# EAGLE design version 1.1 (EAGLE 8.1.0)

## Sheet 1 of 4
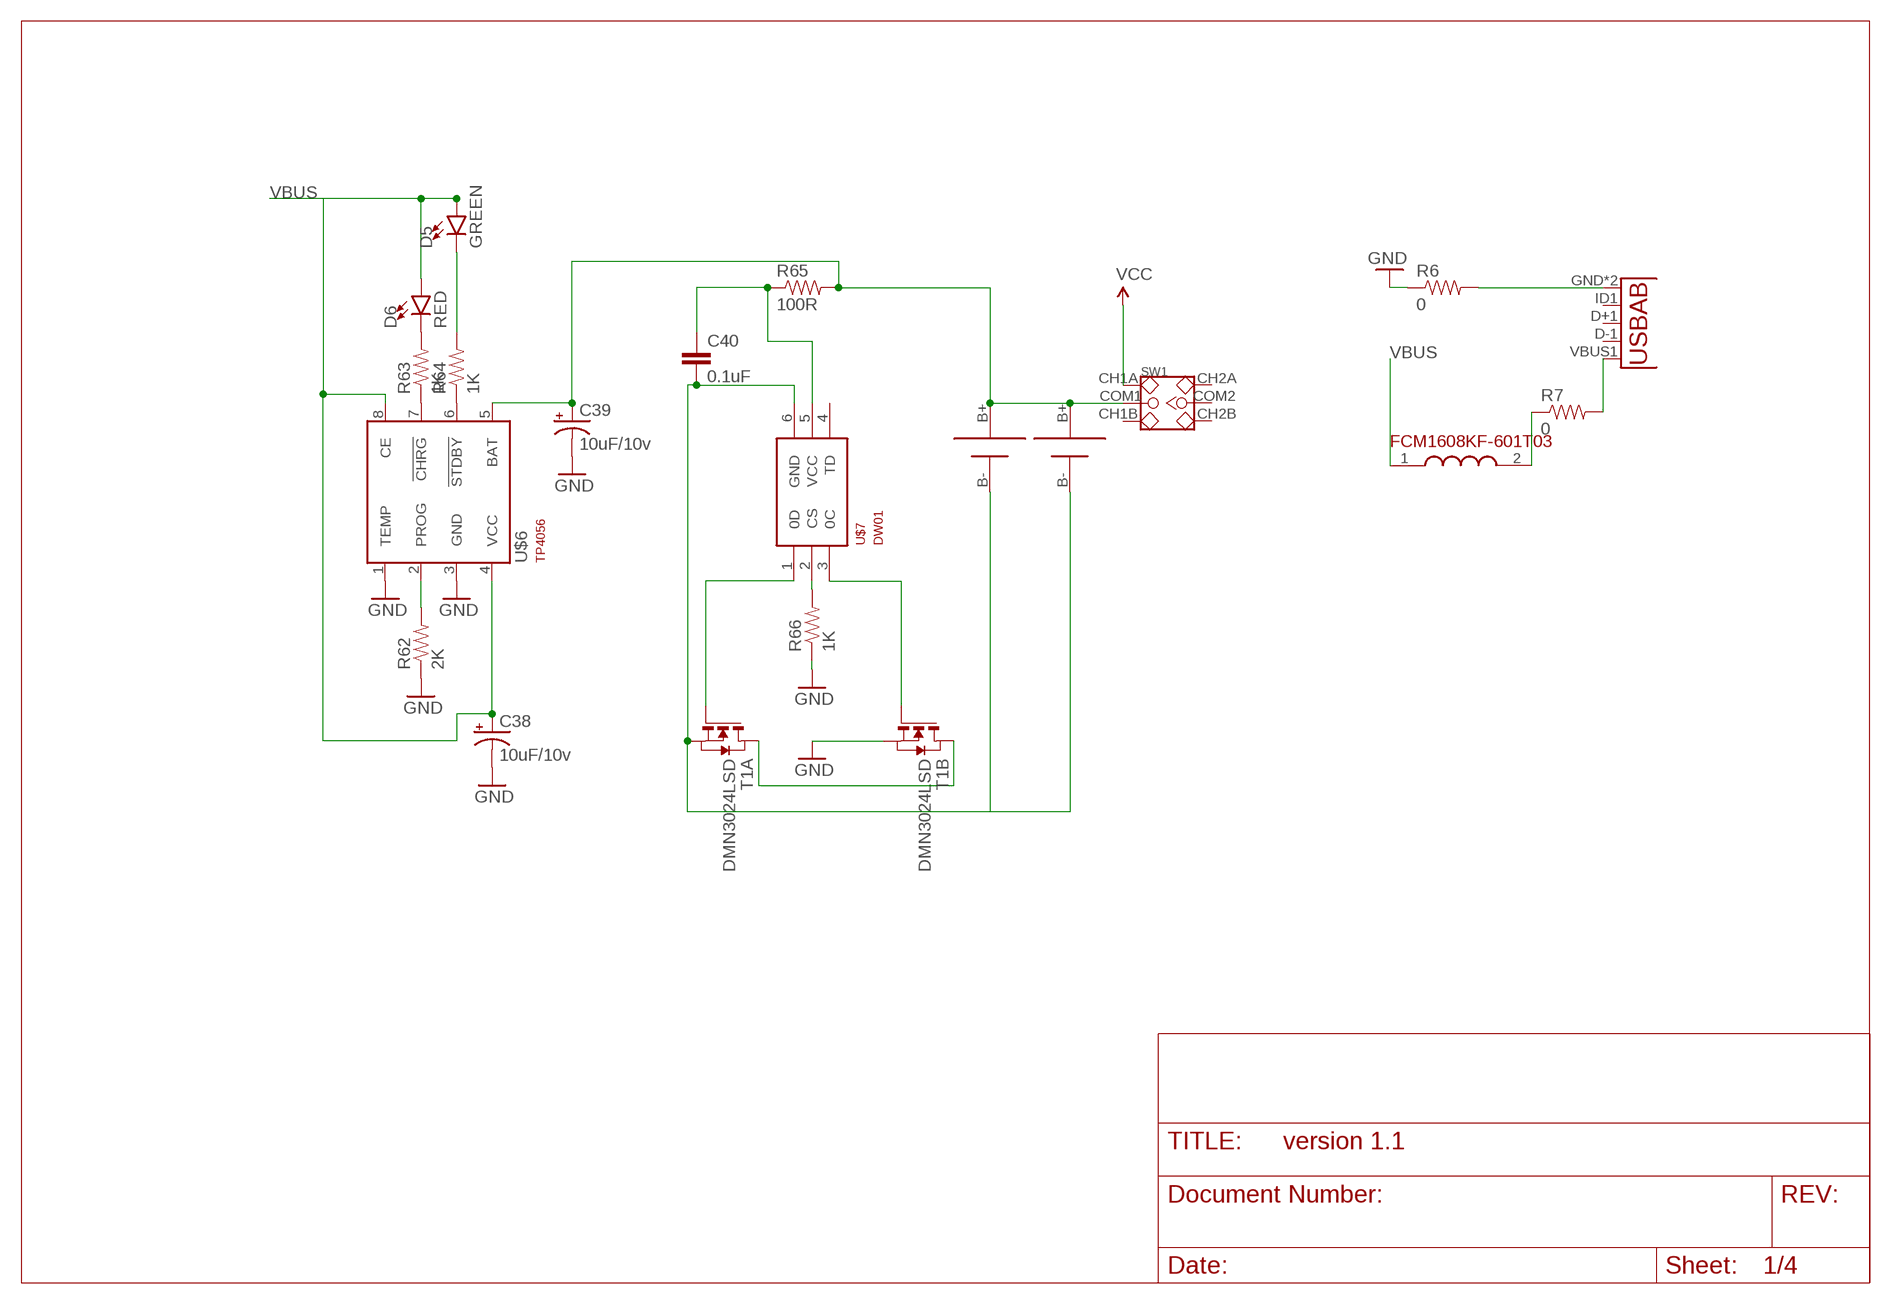
[diagram p0: schematic, sheet 1]

### Parts
C38  10uF/10v  CAP_POL1206-KIT  [EIA3216-KIT]
C39  10uF/10v  CAP_POL1206-KIT  [EIA3216-KIT]
C40  0.1uF  0.1UF-100V-10%(0603)  [0603-CAP]
D5  GREEN  LED-BLUE0603  [LED-0603]
D6  RED  LED-BLUE0603  [LED-0603]
R6  0  RESISTOR0805-RES  [0805]
R7  0  RESISTOR0805-RES  [0805]
R62  2K  1KOHM1/10W1%(0603)  [0603-RES]
R63  1K  1KOHM1/10W1%(0603)  [0603-RES]
R64  1K  1KOHM1/10W1%(0603)  [0603-RES]
R65  100R  1KOHM1/10W1%(0603)  [0603-RES]
R66  1K  1KOHM1/10W1%(0603)  [0603-RES]
SW1  SMD-TOGGLE-SWITCH-2CH(2X3P-7X3.5MM)  [SW6-2.54-SMD-7.0X3.5X1.5MM]
T1  DMN3024LSD  [TSSOP-8]
U1  USB""  [USB-MICRO-SMD]
U$4  FCM1608KF-601T03  [FCM1608KF-601T03]
U$5  18650SMD  [18650SMD]
U$6  TP4056  [SOT23-8]
U$7  DW01  [SOT23-6]
U$8  18650SMD  [18650SMD]

### Nets
GND: C38.C(-) C39.C(-) R6.1 R62.1 R66.1 T1.6(B:S) T1.7(B:S) U$6.1(TEMP) U$6.3(GND) ; also sheet 2,3,4
N$3: R7.2 U1.VBUS1(VBUS)
N$4: C39.A(+) R65.2 SW1.COM1 U$5.B+ U$6.5(BAT) U$8.B+
N$11: R7.1 U$4.2(2.OUT)
N$12: R6.2 U1.GND U1.GND1(GND)
N$58: R62.2 U$6.2(PROG)
N$59: R63.1 U$6.7(!CHRG)
N$60: R64.1 U$6.6(!STDBY)
N$61: D6.C R63.2
N$62: D5.C R64.2
N$65: C40.1 R65.1 U$7.5(VCC)
N$66: C40.2 T1.2(A:S) T1.3(A:S) U$5.B- U$7.6(GND) U$8.B-
N$67: T1.4(A:G) U$7.1(0D)
N$68: R66.2 U$7.2(CS)
N$69: T1.1(A:D) T1.8(B:D)
N$70: T1.5(B:G) U$7.3(0C)
VBUS: C38.A(+) D5.A D6.A U$4.1(1.IN) U$6.4(VCC) U$6.8(CE)
VCC: SW1.CH1A ; also sheet 2,3,4
Unconnected: SW1.CH1B SW1.CH2A SW1.CH2B SW1.COM2 U1.D+1(D+) U1.D-1(D-) U1.ID1(USBID) U$7.4(TD)

## Sheet 2 of 4
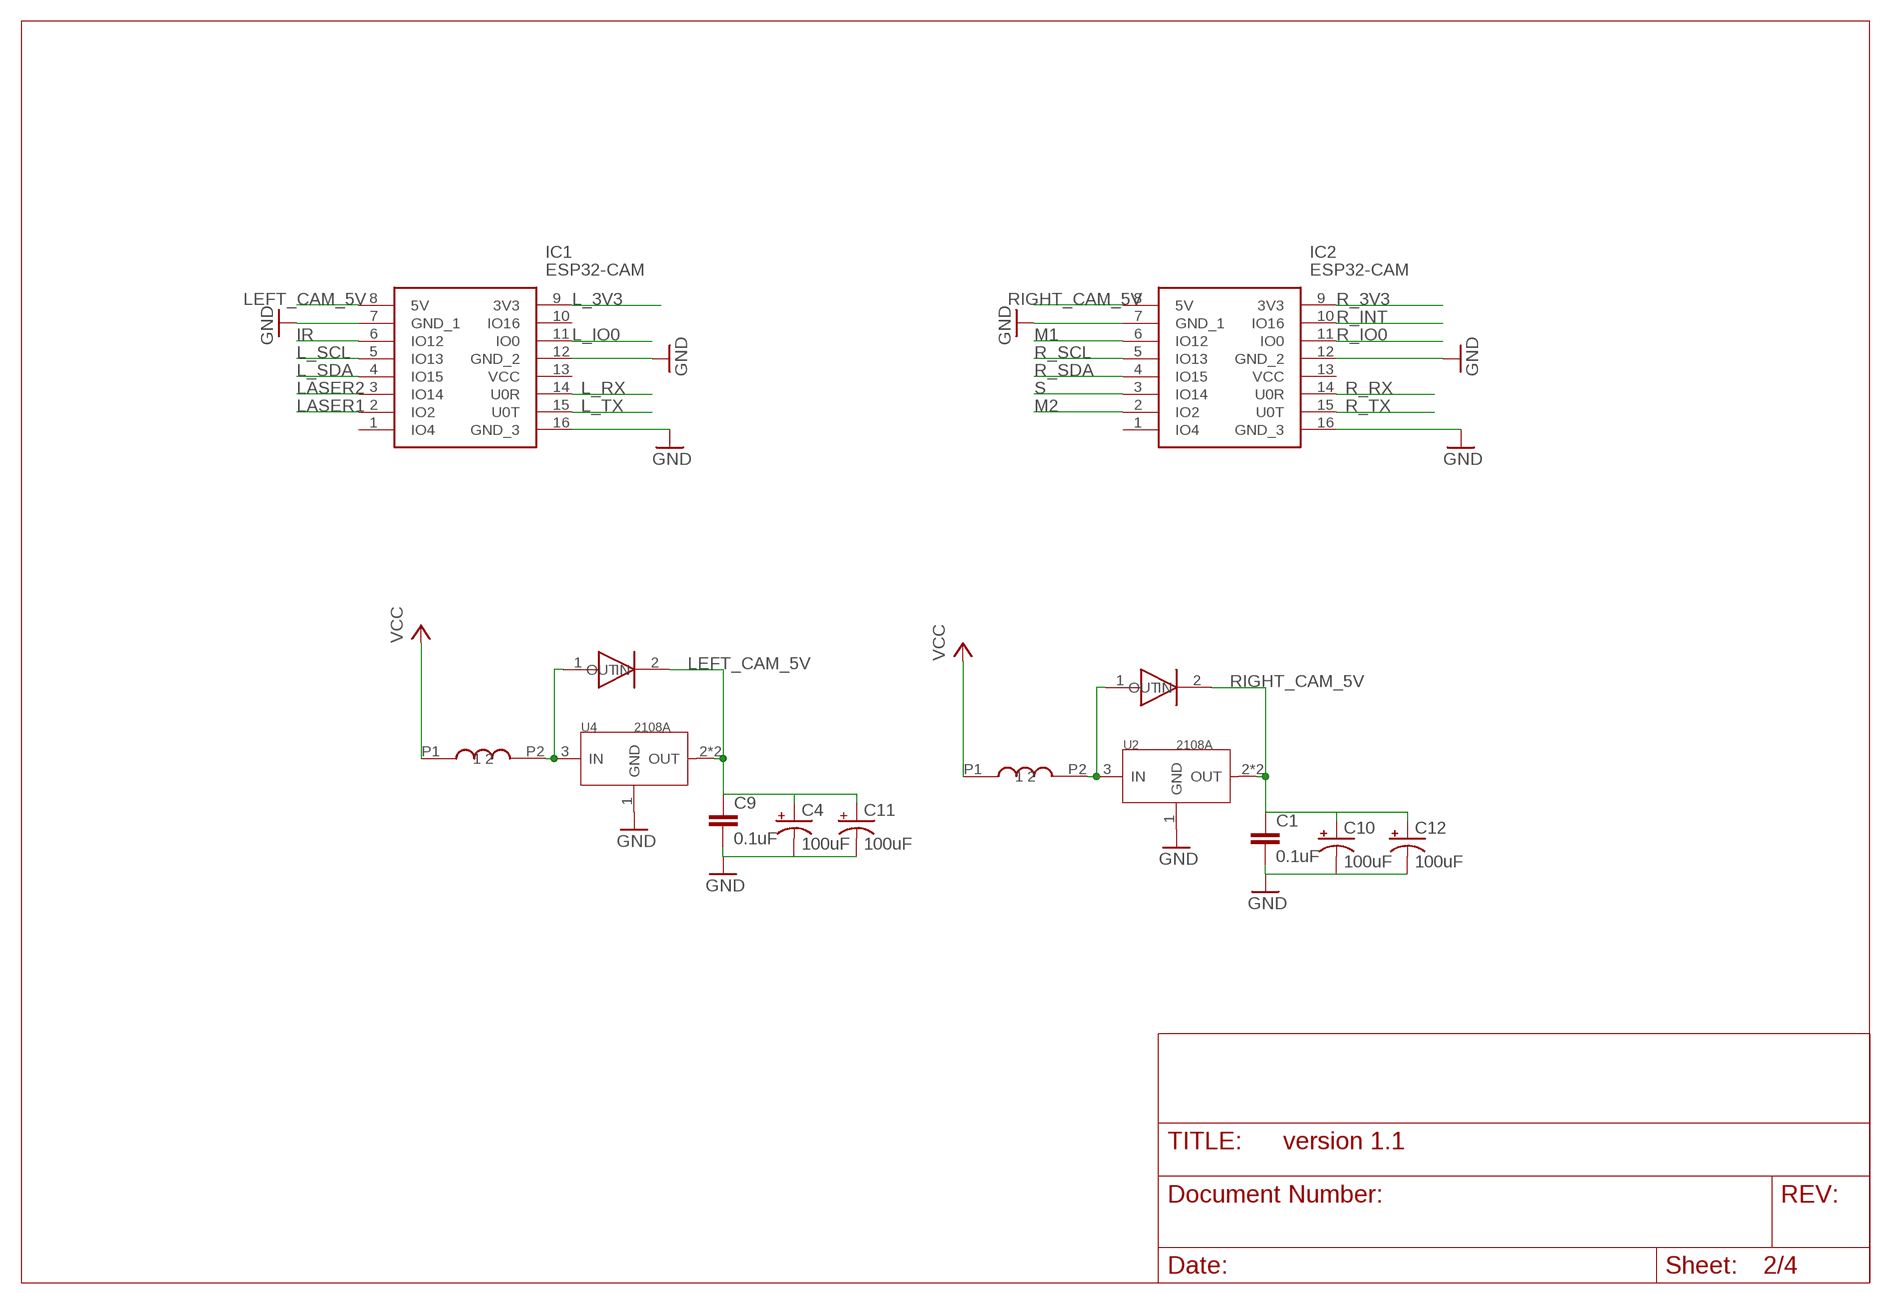
[diagram p1: schematic, sheet 2]

### Parts
C1  0.1uF  0.1UF-25V-5%(0603)  [0603-CAP]
C4  100uF  CPOL-USE/7260-38R  [E/7260-38R]
C9  0.1uF  0.1UF-25V-5%(0603)  [0603-CAP]
C10  100uF  CPOL-USE/7260-38R  [E/7260-38R]
C11  100uF  CPOL-USE/7260-38R  [E/7260-38R]
C12  100uF  CPOL-USE/7260-38R  [E/7260-38R]
IC1  ESP32-CAM  [ESP32CAM]
IC2  ESP32-CAM  [ESP32CAM]
U2  2108A  PMIC-CJA1117B-3.3(SOT-89)  [SOT-89]
U4  2108A  PMIC-CJA1117B-3.3(SOT-89)  [SOT-89]
U$13  CD54  [CD54]
U$14  SMA-SS34  [SMA-SS34]
U$15  SMA-SS34  [SMA-SS34]
U$16  CD54  [CD54]

### Nets
GND: C1.2 C4.- C9.2 C10.- C11.- C12.- IC1.7(GND_1) IC1.12(GND_2) IC1.16(GND_3) IC2.7(GND_1) IC2.12(GND_2) IC2.16(GND_3) U2.1(GND) U4.1(GND) ; also sheet 1,3,4
IR: IC1.6(IO12) ; also sheet 3
L_3V3: IC1.9(3V3) ; also sheet 4
L_IO0: IC1.11(IO0) ; also sheet 4
L_RX: IC1.14(U0R) ; also sheet 4
L_SCL: IC1.5(IO13) ; also sheet 4
L_SDA: IC1.4(IO15) ; also sheet 4
L_TX: IC1.15(U0T) ; also sheet 4
LASER1: IC1.2(IO2) ; also sheet 3
LASER2: IC1.3(IO14) ; also sheet 3
LEFT_CAM_5V: C4.+ C9.1 C11.+ IC1.8(5V) U4.2(OUT) U4.4(OUT) U$14.2(OUT) ; also sheet 4
M1: IC2.6(IO12) ; also sheet 4
M2: IC2.2(IO2) ; also sheet 4
N$17: U4.3(IN) U$13.P2 U$14.1(IN)
N$19: U2.3(IN) U$15.1(IN) U$16.P2
R_3V3: IC2.9(3V3) ; also sheet 4
R_INT: IC2.10(IO16) ; also sheet 4
R_IO0: IC2.11(IO0) ; also sheet 4
R_RX: IC2.14(U0R) ; also sheet 4
R_SCL: IC2.5(IO13) ; also sheet 4
R_SDA: IC2.4(IO15) ; also sheet 4
R_TX: IC2.15(U0T) ; also sheet 4
RIGHT_CAM_5V: C1.1 C10.+ C12.+ IC2.8(5V) U2.2(OUT) U2.4(OUT) U$15.2(OUT) ; also sheet 4
S: IC2.3(IO14) ; also sheet 4
VCC: U$13.P1 U$16.P1 ; also sheet 1,3,4
Unconnected: IC1.1(IO4) IC1.10(IO16) IC1.13(VCC) IC2.1(IO4) IC2.13(VCC)

## Sheet 3 of 4
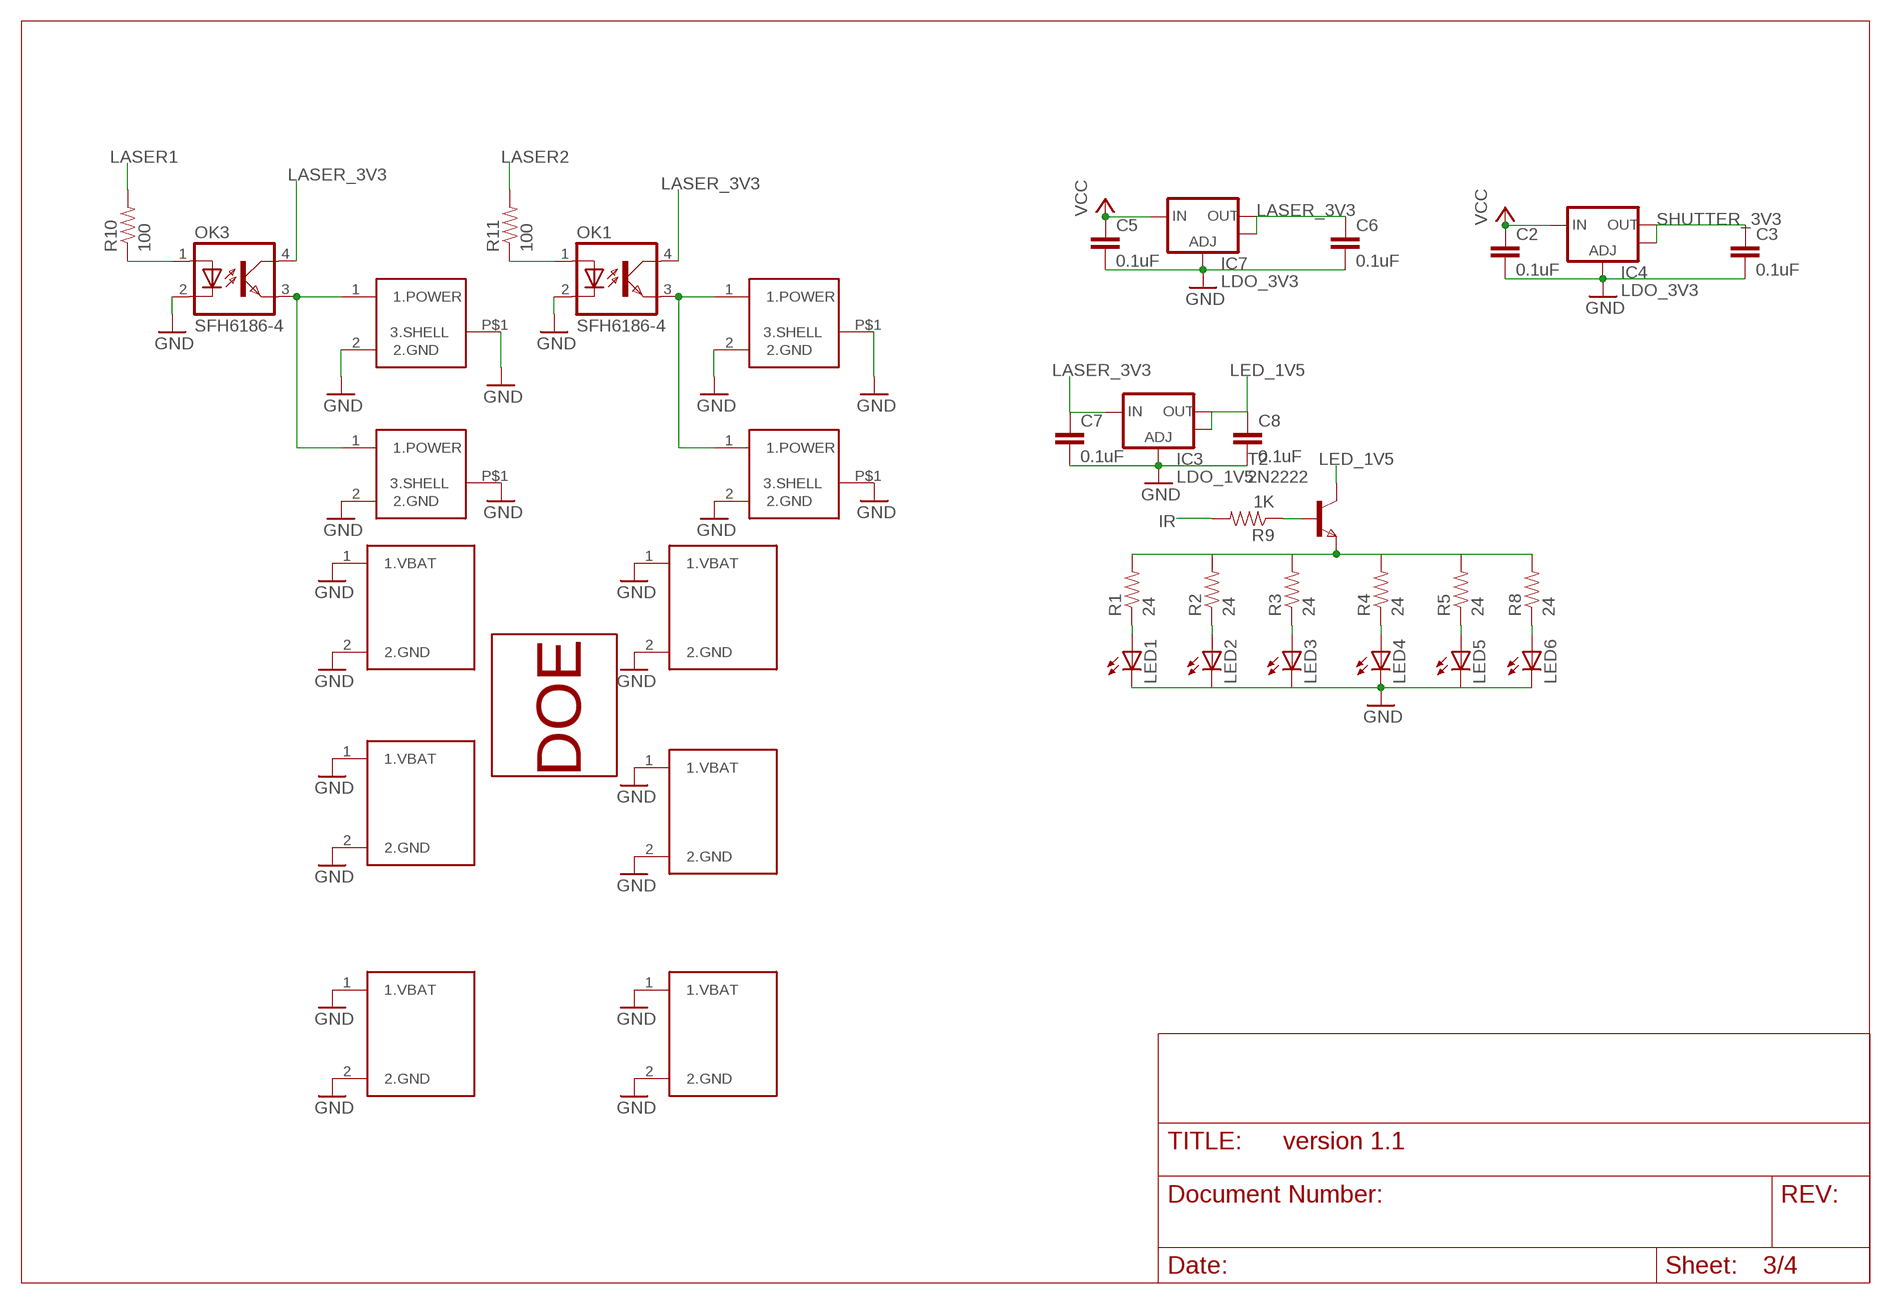
[diagram p2: schematic, sheet 3]

### Parts
C2  0.1uF  0.1UF-100V-10%(0603)  [0603-CAP]
C3  0.1uF  0.1UF-100V-10%(0603)  [0603-CAP]
C5  0.1uF  0.1UF-100V-10%(0603)  [0603-CAP]
C6  0.1uF  0.1UF-100V-10%(0603)  [0603-CAP]
C7  0.1uF  0.1UF-100V-10%(0603)  [0603-CAP]
C8  0.1uF  0.1UF-100V-10%(0603)  [0603-CAP]
IC3  LDO_1V5  V_REG_LM1117SOT223  [SOT223]
IC4  LDO_3V3  V_REG_LM1117SOT223  [SOT223]
IC7  LDO_3V3  V_REG_LM1117SOT223  [SOT223]
LED1  LED5MM  [LED5MM]
LED2  LED5MM  [LED5MM]
LED3  LED5MM  [LED5MM]
LED4  LED5MM  [LED5MM]
LED5  LED5MM  [LED5MM]
LED6  LED5MM  [LED5MM]
OK1  SFH6186-4  [SMD4-7]
OK3  SFH6186-4  [SMD4-7]
R1  24  1KOHM1/10W1%(0603)  [0603-RES]
R2  24  1KOHM1/10W1%(0603)  [0603-RES]
R3  24  1KOHM1/10W1%(0603)  [0603-RES]
R4  24  1KOHM1/10W1%(0603)  [0603-RES]
R5  24  1KOHM1/10W1%(0603)  [0603-RES]
R8  24  1KOHM1/10W1%(0603)  [0603-RES]
R9  1K  1KOHM1/10W1%(0603)  [0603-RES]
R10  100  1KOHM1/10W1%(0603)  [0603-RES]
R11  100  1KOHM1/10W1%(0603)  [0603-RES]
T2  2N2222  FMMT451  [SOT-23]
U$1  OD-6.5MM-LASER  [OD-6.5MM-LASER]
U$2  OD-6.5MM-LASER  [OD-6.5MM-LASER]
U$3  DOE-MODULE  [DOE-MODULE]
U$9  CR2025-HOLDER  [CR2025-HOLDER]
U$10  CR2025-HOLDER  [CR2025-HOLDER]
U$11  CR2025-HOLDER  [CR2025-HOLDER]
U$12  CR2025-HOLDER  [CR2025-HOLDER]
U$17  CR2025-HOLDER  [CR2025-HOLDER]
U$18  CR2025-HOLDER  [CR2025-HOLDER]
U$19  OD-9MM-LASER  [OD-9MM-LASER]
U$20  OD-12MM-LASER  [OD-12MM-LASER]

### Nets
GND: C2.2 C3.2 C5.2 C6.2 C7.2 C8.2 IC3.1(ADJ) IC4.1(ADJ) IC7.1(ADJ) LED1.K(C) LED2.K(C) LED3.K(C) LED4.K(C) LED5.K(C) LED6.K(C) OK1.2(C) OK3.2(C) U$1.2(2.GND) U$1.P$1(3.SHELL) U$2.2(2.GND) U$2.P$1(3.SHELL) U$9.1(1.VBAT) U$9.2(2.GND) U$10.1(1.VBAT) U$10.2(2.GND) U$11.1(1.VBAT) U$11.2(2.GND) U$12.1(1.VBAT) U$12.2(2.GND) U$17.1(1.VBAT) U$17.2(2.GND) U$18.1(1.VBAT) U$18.2(2.GND) U$19.2(2.GND) U$19.P$1(3.SHELL) U$20.2(2.GND) U$20.P$1(3.SHELL) ; also sheet 1,2,4
IR: R9.2 ; also sheet 2
LASER1: R10.2 ; also sheet 2
LASER2: R11.2 ; also sheet 2
LASER_3V3: C6.1 C7.1 IC3.3(IN) IC7.2(OUT) IC7.4(OUT) OK1.4(COL) OK3.4(COL)
LED_1V5: C8.1 IC3.2(OUT) IC3.4(OUT) T2.1(C)
N$5: OK3.3(EMIT) U$1.1(1.POWER) U$20.1(1.POWER)
N$6: OK1.3(EMIT) U$2.1(1.POWER) U$19.1(1.POWER)
N$7: OK3.1(A) R10.1
N$8: OK1.1(A) R11.1
N$9: LED1.A R1.1
N$10: LED2.A R2.1
N$13: LED3.A R3.1
N$14: LED4.A R4.1
N$15: LED5.A R5.1
N$16: LED6.A R8.1
N$18: R1.2 R2.2 R3.2 R4.2 R5.2 R8.2 T2.2(E)
N$21: R9.1 T2.3(B)
SHUTTER_3V3: C3.1 IC4.2(OUT) IC4.4(OUT) ; also sheet 4
VCC: C2.1 C5.1 IC4.3(IN) IC7.3(IN) ; also sheet 1,2,4

## Sheet 4 of 4
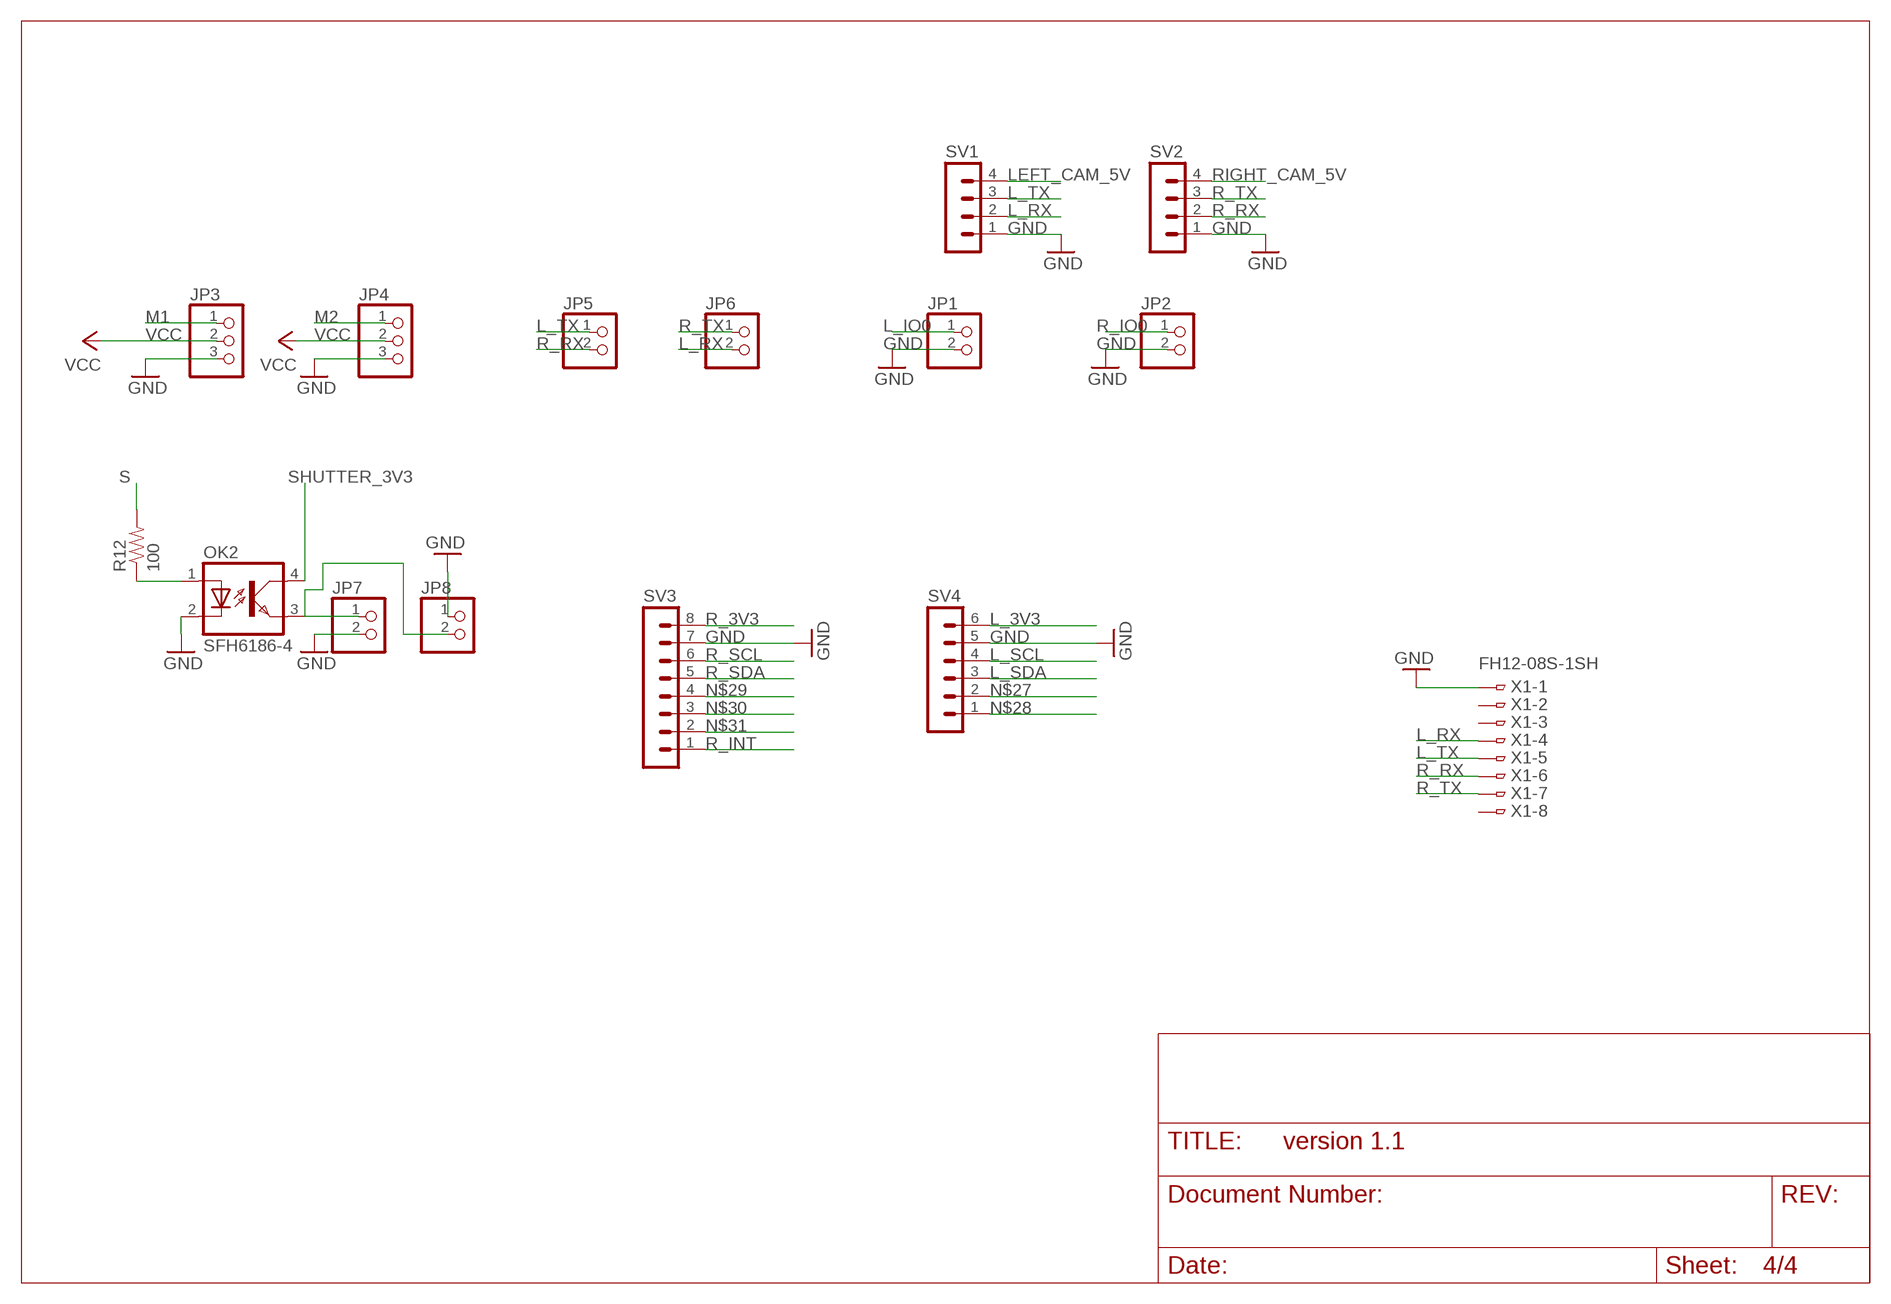
[diagram p3: schematic, sheet 4]

### Parts
JP1  PINHD-1X2  [1X02]
JP2  PINHD-1X2  [1X02]
JP3  PINHD-1X3  [1X03]
JP4  PINHD-1X3  [1X03]
JP5  PINHD-1X2  [1X02]
JP6  PINHD-1X2  [1X02]
JP7  PINHD-1X2  [1X02]
JP8  PINHD-1X2  [1X02]
OK2  SFH6186-4  [SMD4-7]
R12  100  1KOHM1/10W1%(0603)  [0603-RES]
SV1  MA04-1  [MA04-1]
SV2  MA04-1  [MA04-1]
SV3  MA08-1  [MA08-1]
SV4  MA06-1  [MA06-1]
X1  FH12-08S-1SH  [FH12-08S-1SH]

### Nets
GND: JP1.2 JP2.2 JP3.3 JP4.3 JP7.2 JP8.1 OK2.2(C) SV1.1 SV2.1 SV3.7 SV4.5 X1.1 ; also sheet 1,2,3
L_3V3: SV4.6 ; also sheet 2
L_IO0: JP1.1 ; also sheet 2
L_RX: JP6.2 SV1.2 X1.4 ; also sheet 2
L_SCL: SV4.4 ; also sheet 2
L_SDA: SV4.3 ; also sheet 2
L_TX: JP5.1 SV1.3 X1.5 ; also sheet 2
LEFT_CAM_5V: SV1.4 ; also sheet 2
M1: JP3.1 ; also sheet 2
M2: JP4.1 ; also sheet 2
N$20: OK2.1(A) R12.1
N$22: JP7.1 JP8.2 OK2.3(EMIT)
N$27: SV4.2
N$28: SV4.1
N$29: SV3.4
N$30: SV3.3
N$31: SV3.2
R_3V3: SV3.8 ; also sheet 2
R_INT: SV3.1 ; also sheet 2
R_IO0: JP2.1 ; also sheet 2
R_RX: JP5.2 SV2.2 X1.6 ; also sheet 2
R_SCL: SV3.6 ; also sheet 2
R_SDA: SV3.5 ; also sheet 2
R_TX: JP6.1 SV2.3 X1.7 ; also sheet 2
RIGHT_CAM_5V: SV2.4 ; also sheet 2
S: R12.2 ; also sheet 2
SHUTTER_3V3: OK2.4(COL) ; also sheet 3
VCC: JP3.2 JP4.2 ; also sheet 1,2,3
Unconnected: X1.2 X1.3 X1.8

## Library data of the parts
C1 C9 = SparkFun-Capacitors:0.1UF-25V-5%(0603): CAP-08604; PROD_ID: CAP-08604
C2 C3 C5-C8 C40 = SparkFun-Capacitors:0.1UF-100V-10%(0603): CAP-08390; PROD_ID: CAP-08390
C4 C10-C12 = adafruit:CPOL-US: POLARIZED CAPACITOR, American symbol
C38 C39 = SparkFun-Capacitors:CAP_POL: Capacitor Polarized These are standard SMD and PTH capacitors. Normally 10uF, 47uF, and 100uF in electrolytic and tantalum varieties. Always verify the external diameter of the through hole cap, it varies with capacity, voltage, and manufacturer. The EIA devices should be standard.
D5 D6 = SparkFun-LED:LED-BLUE: Blue SMD LED Used in manufacturing of various products at SparkFun Packages: 0603 - SMD 0603 package [Product Link] <http://www.digikey.com/product-detail/en/SMLE12BC7TT86/511-1589-2-ND/1641808> 1206 - SMD1206 package [Product Link] <http://www.digikey.com/product-detail/en/lite-on-inc/LTST-C150TBKT/160-1643-1-ND/573584> SparkFun Products: ESP8266 Thing-Dev Board <https://www.sparkfun.com/products/13711> RedBoard <https://www.sparkfun.com/products/12757>; PROD_ID: DIO-08575; VALUE: BLUE
IC1 IC2 = ESP32-CAM:ESP32-CAM: Modules PCBA Module RoHS Source: Datasheet <https://datasheet.lcsc.com/szlcsc/Ai-Thinker-ESP32-CAM_C277946.pdf>; DESCRIPTION: Modules PCBA Module RoHS; HEIGHT: 5mm; MANUFACTURER_NAME: Ai-Thinker; MANUFACTURER_PART_NUMBER: ESP32-CAM
IC3 IC4 IC7 = SparkFun-PowerIC:V_REG_LM1117: Voltage Regulator LM1117 Standard adjustable voltage regulator but in SMD form. Spark Fun Electronics SKU : COM-00595
JP1 JP2 JP5-JP8 = pinhead:PINHD-1X2: PIN HEADER
JP3 JP4 = adafruit:PINHD-1X3: PIN HEADER
LED1-LED6 = adafruit:LED: LED OSRAM: - CHIPLED LG R971, LG N971, LY N971, LG Q971, LY Q971, LO R971, LY R971 LH N974, LH R974 LS Q976, LO Q976, LY Q976 LO Q996 - Hyper CHIPLED LW Q18S LB Q993, LB Q99A, LB R99A - SideLED LS A670, LO A670, LY A670, LG A670, LP A670 LB A673, LV A673, LT A673, LW A673 LH A674 LY A675 LS A676, LA A676, LO A676, LY A676, LW A676 LS A679, LY A679, LG A679 - Hyper Micro SIDELED® LS Y876, LA Y876, LO Y876, LY Y876 LT Y87S - SmartLED LW L88C, LW L88S LB L89C, LB L89S, LG L890 LS L89K, LO L89K, LY L89K LS L896, LA L896, LO L896, LY L896 - TOPLED LS T670, LO T670, LY T670, LG T670, LP T670 LSG T670, LSP T670, LSY T670, LOP T670, LYG T670 LG T671, LOG T671, LSG T671 LB T673, LV T673, LT T673, LW T673 LH T674 LS T676, LA T676, LO T676, LY T676, LB T676, LH T676, LSB T676, LW T676 LB T67C, LV T67C, LT T67C, LS T67K, LO T67K, LY T67K, LW E67C LS E67B, LA E67B, LO E67B, LY E67B, LB E67C, LV E67C, LT E67C LW T67C LS T679, LY T679, LG T679 LS T770, LO T770, LY T770, LG T770, LP T770 LB T773, LV T773, LT T773, LW T773 LH T774 LS E675, LA E675, LY E675, LS T675 LS T776, LA T776, LO T776, LY T776, LB T776 LHGB T686 LT T68C, LB T68C - Hyper Mini TOPLED® LB M676 - Mini TOPLED Santana® LG M470 LS M47K, LO M47K, LY M47K Source: http://www.osram.convergy.de/
OK1-OK3 = optocoupler:SFH618?*: Optocoupler, Phototransistor Output, Low Input Current Source: Data sheet <http://www.vishay.com/docs/83673/sfh618.pdf>; MF: VISHAY/TELEFUNKEN; MPN: SFH6186-4; OC_FARNELL: 1469530; OC_NEWARK: 21H7753
R1-R5 R8 R10-R12 R62 R65 = SparkFun-Resistors:1KOHM1/10W1%(0603): RES-07856; PROD_ID: RES-07856; VALUE: 1K
R6 R7 = SparkFun-Resistors:RESISTOR: Resistor Basic schematic elements and footprints for 0603, 1206, and PTH resistors.
R9 R63 R64 R66 = SparkFun-Resistors:1KOHM1/10W1%(0603): RES-07856; PROD_ID: RES-07856
SV1 SV2 = con-lstb:MA04-1: PIN HEADER; OC_FARNELL: unknown; OC_NEWARK: unknown
SV3 = con-lstb:MA08-1: PIN HEADER; OC_FARNELL: unknown; OC_NEWARK: unknown
SV4 = con-lstb:MA06-1: PIN HEADER; OC_FARNELL: unknown; OC_NEWARK: unknown
SW1 = Seeed-OPL-Switch:SMD-TOGGLE-SWITCH-2CH(2X3P-7X3.5MM): 311030005
T1 = FS8205A:DMN3024LSD: DUAL N-CHANNEL ENHANCEMENT MODE MOSFET data sheet <http://goo.gl/dRgboR> Dave.Calaway Eagle Library <https://goo.gl/Muy1Tr>
T2 = zetex:FMMT451: NPN TRANSISTOR; OC_FARNELL: unknown; OC_NEWARK: unknown
U1 = MicroUSB Long GND:USB: This is a USB AB connector that is compatible with USB OTG. i.e. this connector can serve as a host or device
U2 U4 = Seeed-OPL-ic:PMIC-CJA1117B-3.3(SOT-89): 310030095; MPN: CJA1117B-3.3; VALUE: CJA1117B-3.3-SOT89
U$1 U$2 = OD-6.5MM-LASER:OD-6.5MM-LASER
U$3 = DOE-MODULE:DOE-MODULE
U$4 = FCM1608KF-601T03:FCM1608KF-601T03
U$5 U$8 = 18650SMD:18650SMD
U$6 = TP4056:TP4056: TP4056 Data sheet <http://goo.gl/J7k8TF> Dave.Calaway Eagle Library <https://goo.gl/Muy1Tr>
U$7 = DW01:DW01: The DW01-P battery protection IC is designed to protect lithium-ion/polymer battery from damage or degrading the lifetime due to overcharge, overdischarge, and/or overcurrent for one-cell lithium-ion/polymer battery powered systems, such as cellular phones. Data sheet <http://goo.gl/4y108d> Dave.Calaway Eagle Library <https://goo.gl/Muy1Tr>
U$9-U$12 U$17 U$18 = CR2025-HOLDER:CR2025-HOLDER
U$13 U$16 = CD54:CD54
U$14 U$15 = SMA-SS34:SMA-SS34
U$19 = OD-9MM-LASER:OD-9MM-LASER
U$20 = OD-12MM-LASER:OD-12MM-LASER
X1 = con-hirose:FH12-08S-1S: 1mm Pitch Connectors For FPC/FFC Source: Data sheet <http://www.hirose.co.jp/cataloge_hp/e58605370.pdf>; OC_FARNELL: unknown; OC_NEWARK: unknown

## Board
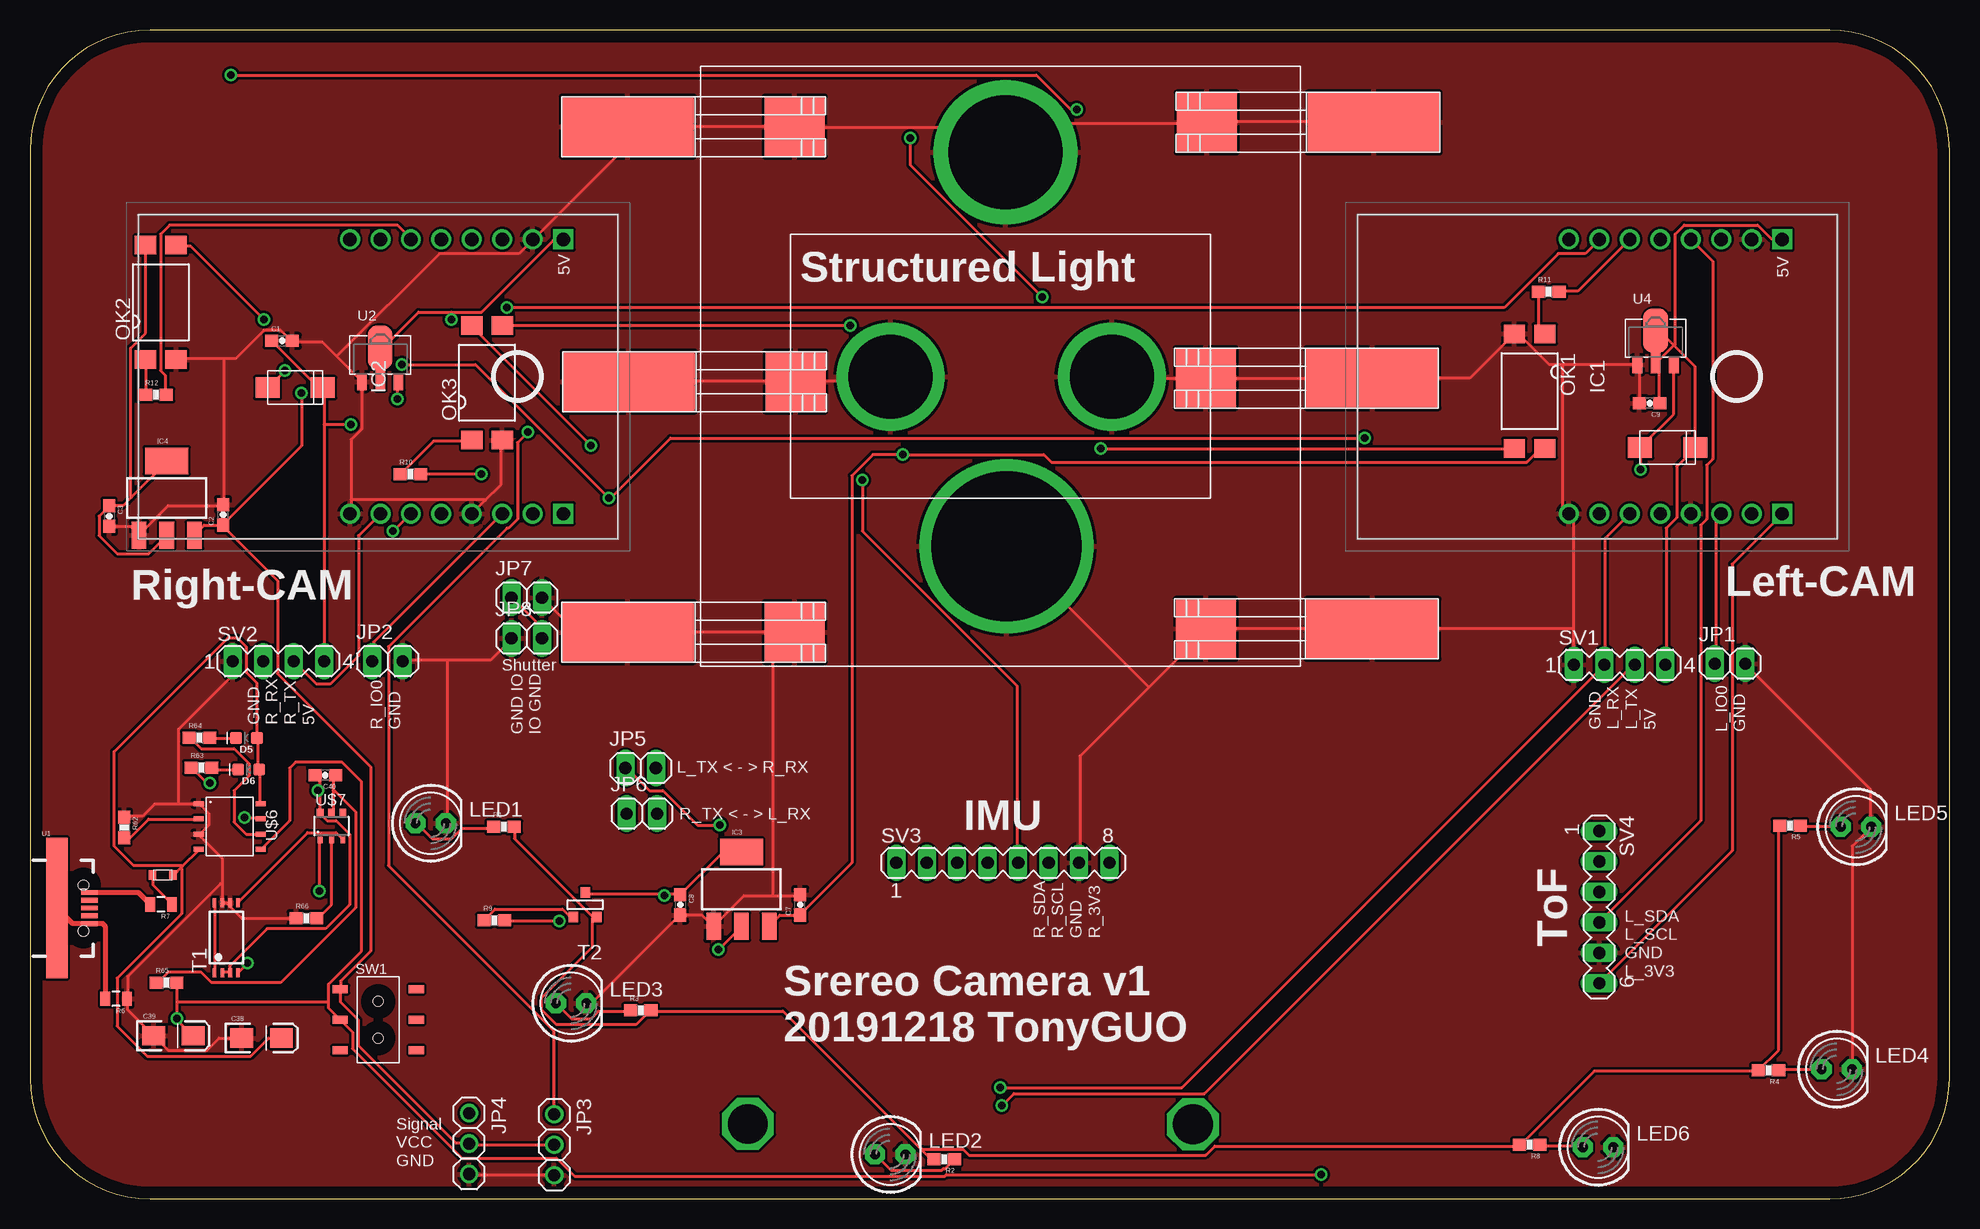
[diagram p4: board, top side]
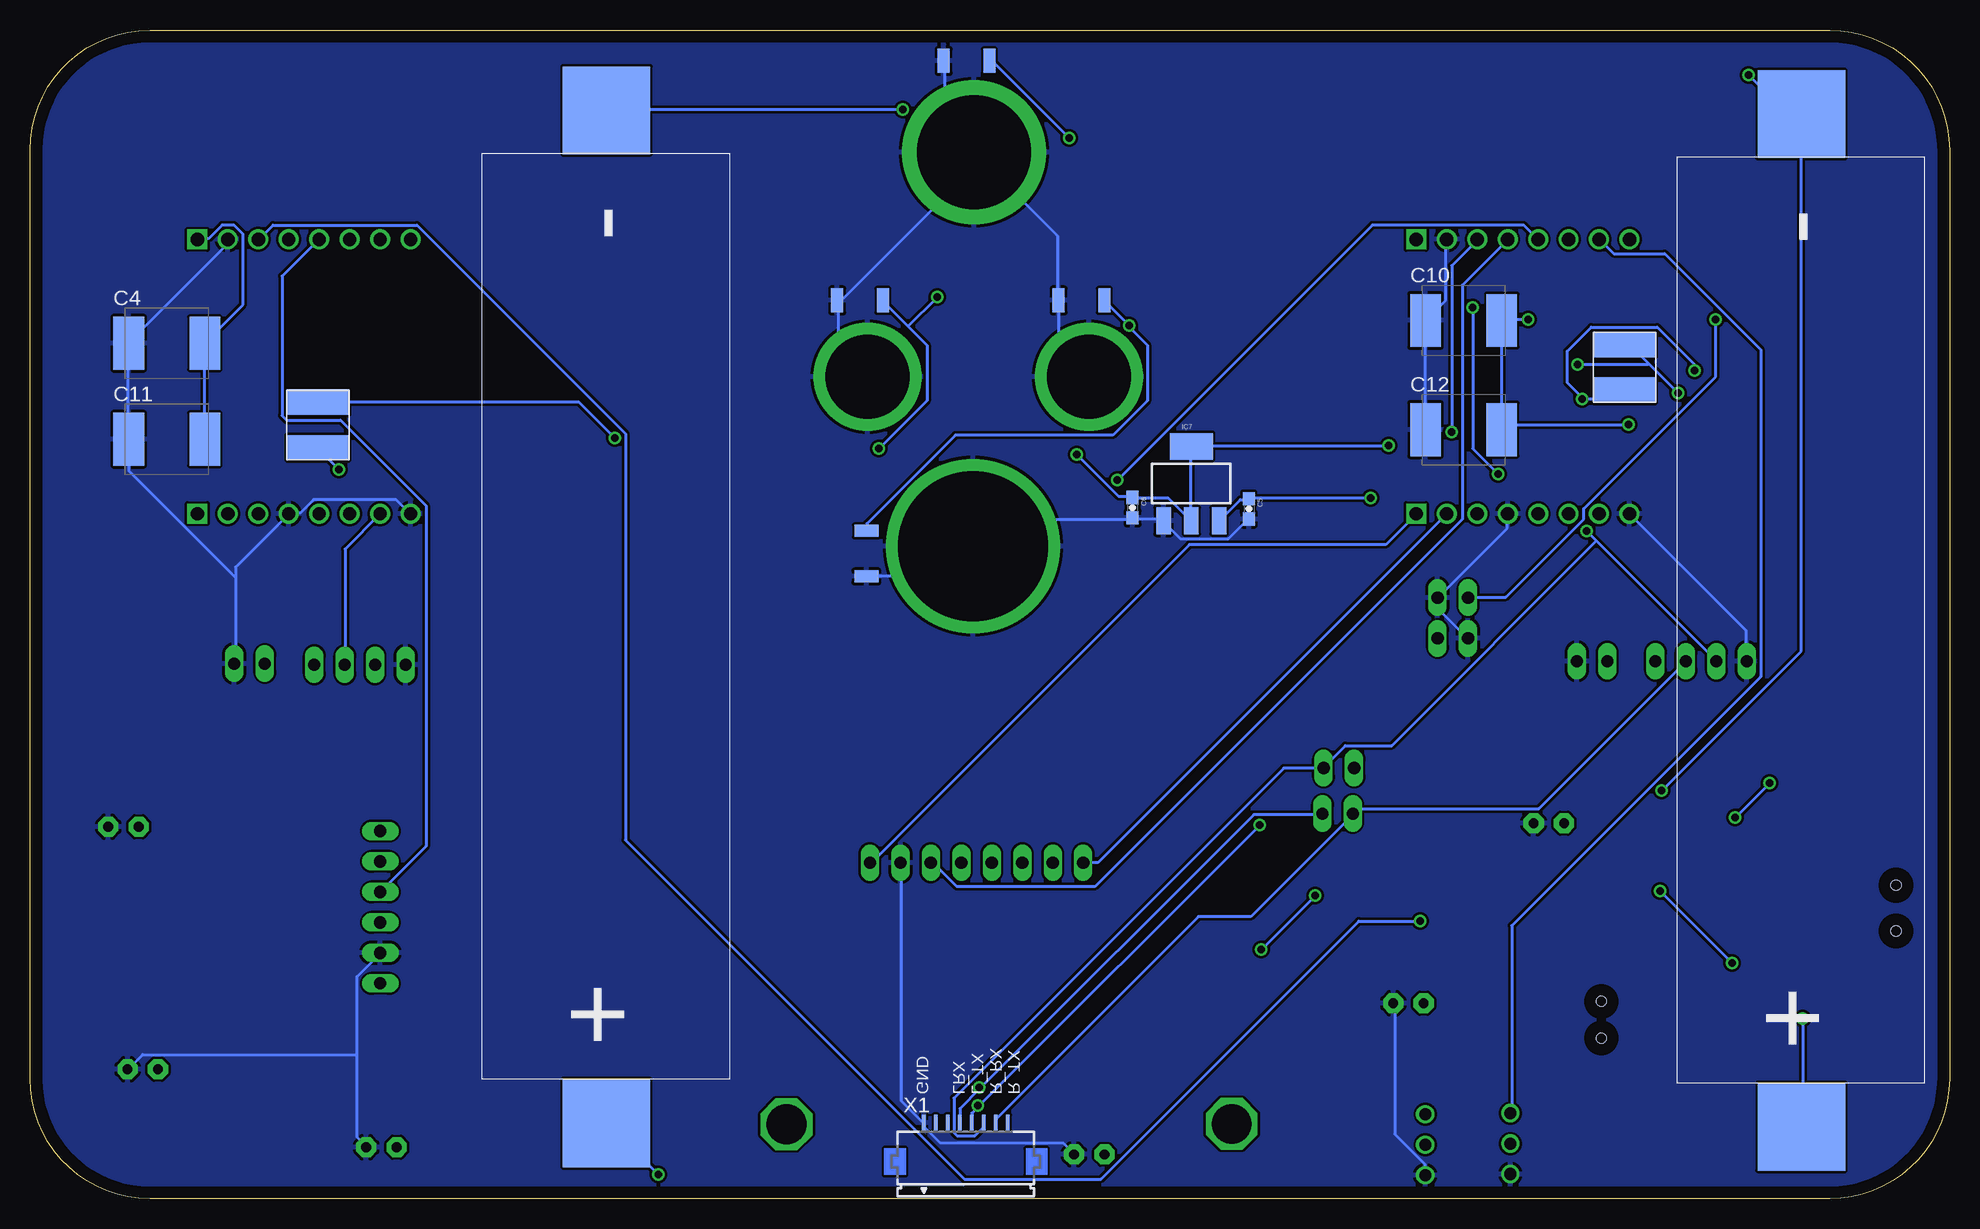
[diagram p5: board, bottom side, seen from below]

Size 160 x 97.4 mm. Coordinates in mm from the lower left corner, seen from the top.
Outline: 150,97.4 10,97.4 arc90 0,87.4 0,10 arc90 10,0 150,0 arc90 160,10 160,87.4 arc90 150,97.4
Copper layers (1*16): Top 0.035mm / dielectric 1.5mm / Bottom 0.035mm
Design rules "default": minimum track width 10mil, minimum drill 24mil, track to track 8mil, track to pad 8mil, pad to pad 8mil, via to via 8mil, smd to smd 8mil, copper to edge 40mil, drill to drill 8mil, minimum pad ring 10mil, minimum via ring 8mil, stop-mask expansion 4mil, vias tented up to drill 0mil, thermal gap 10mil

### Footprints (pad centres in the part's own frame; a part is rotated, then mirrored left to right if it is on the bottom)
0603-CAP = smd 1.1 x 1: 1 -0.85,0; 2 0.85,0
E/7260-38R = smd 2.55 x 4.4: + 3.175,0; - -3.175,0
EIA3216-KIT = smd 1.9 x 1.6: A 1.65,0; C -1.65,0
LED-0603 = smd 1 x 1: A -0.877,0; C 0.877,0
ESP32CAM = drill 1.11 pad 1.665: 1 0,0; 2 0,2.54; 3 0,5.08; 4 0,7.62; 5 0,10.16; 6 0,12.7; 7 0,15.24; 10 22.86,15.24; 11 22.86,12.7; 12 22.86,10.16; 13 22.86,7.62; 14 22.86,5.08; 15 22.86,2.54; 16 22.86,0 | drill 1.11 pad 1.665 square: 8 0,17.78; 9 22.86,17.78
SOT223 = smd 1.219 x 2.235: 1 -2.311,-3.099; 2 0,-3.099; 3 2.311,-3.099 | smd 3.6 x 2.2: 4 0,3.099
1X02 = drill 1.016 long: 1 -1.27,0; 2 1.27,0
1X03 = drill 1.016: 1 -2.54,0; 2 0,0; 3 2.54,0
LED5MM = drill 0.813 pad 1.676 octagon: A -1.27,0; K 1.27,0
SMD4-7 = smd 1.78 x 1.55: 1 -1.27,-4.77; 2 1.27,-4.77; 3 1.27,4.77; 4 -1.27,4.77
0603-RES = smd 1.1 x 1: 1 -0.85,0; 2 0.85,0
0805 = smd 0.8 x 1.2: 1 -0.9,0; 2 0.9,0
MA04-1 = drill 1.016 long: 1 -3.81,0; 2 -1.27,0; 3 1.27,0; 4 3.81,0
MA08-1 = drill 1.016 long: 1 -8.89,0; 2 -6.35,0; 3 -3.81,0; 4 -1.27,0; 5 1.27,0; 6 3.81,0; 7 6.35,0; 8 8.89,0
MA06-1 = drill 1.016 long: 1 -6.35,0; 2 -3.81,0; 3 -1.27,0; 4 1.27,0; 5 3.81,0; 6 6.35,0
SW6-2.54-SMD-7.0X3.5X1.5MM = smd 1.27 x 0.635: CH1A -3.175,2.54; CH1B -3.175,-2.54; CH2A 3.175,2.54; CH2B 3.175,-2.54; COM1 -3.175,0; COM2 3.175,0 | hole 0.813: 0,1.524; 0,-1.524
TSSOP-8 = smd 0.3 x 0.75: 1 -0.975,-2.925; 2 -0.325,-2.925; 3 0.325,-2.925; 4 0.975,-2.925; 5 0.975,2.925; 6 0.325,2.925; 7 -0.325,2.925; 8 -0.975,2.925
SOT-23 = smd 0.787 x 0.889: 1 0.025,-1.016; 2 -0.94,1.016; 3 0.991,1.016
USB-MICRO-SMD = smd 1.4 x 0.4: D+1 2.7,0; D-1 2.7,0.65; GND1 2.7,-1.3; ID1 2.7,-0.65; VBUS1 2.7,1.3 | smd 1.778 x 11.684: GND 0,0 | hole 0.85: 2.2,1.9; 2.2,-1.9
SOT-89 = smd 0.8 x 1.4: 1 -1.524,-1.905; 3 1.524,-1.905 | smd 0.8 x 1.9: 2 0,-1.651 | smd 2.032 x 3.65: 4 0,0.94
OD-6.5MM-LASER = smd 2 x 1: 1 -6.35,1.27; 2 -6.35,-2.54 | drill 7 pad 9: P$1 0,0
FCM1608KF-601T03 = smd 0.6 x 0.8: 1 -0.05,0.4; 2 1.65,0.4
18650SMD = smd 7.3 x 7.3: B+ -3.7,10.3; B- 80.7,10.3
SOT23-8 = smd 0.42 x 0.835: 1 -1.905,-2.58; 2 -0.635,-2.58; 3 0.635,-2.58; 4 1.905,-2.58; 5 1.905,2.58; 6 0.635,2.58; 7 -0.635,2.58; 8 -1.905,2.58
SOT23-6 = smd 0.4 x 0.55: 1 -0.95,-1.15; 2 0,-1.15; 3 0.95,-1.15 | smd 0.55 x 0.55: 4 0.95,1.15; 5 0,1.15; 6 -0.95,1.15
CR2025-HOLDER = smd 11 x 5: 1 0,0 | smd 5 x 5: 2 13.9,0
CD54 = smd 5.2 x 2.1: P1 2.6,-1; P2 2.6,-4.8
SMA-SS34 = smd 2 x 1.7: 1 0,-1.4; 2 4.6,-1.4
OD-9MM-LASER = smd 2 x 1: 1 -7.62,1.27; 2 -7.62,-2.54 | drill 9.5 pad 12: P$1 0,0
OD-12MM-LASER = smd 2 x 1: 1 -8.89,1.27; 2 -8.89,-2.54 | drill 12.5 pad 14.5: P$1 0,0
FH12-08S-1SH = smd 0.3 x 1.3: 1 -3.5,3.25; 2 -2.5,3.25; 3 -1.5,3.25; 4 -0.5,3.25; 5 0.5,3.25; 6 1.5,3.25; 7 2.5,3.25; 8 3.5,3.25

### Placement (x,y rotation side)
C1  21,71.5 0 top
C2  16.1,57 90 top
C3  6.6,56.9 270 top
C4  148.6,71.3 0 bottom
C5  58.4,57.5 270 bottom
C6  68.1,57.6 270 bottom
C7  64.2,24.5 90 top
C8  54.2,24.5 270 top
C9  135,66.3 180 top
C10  40.5,73.2 0 bottom
C11  148.6,63.3 0 bottom
C12  40.5,64.1 0 bottom
C38  19.3,13.4 0 top
C39  11.95,13.59 0 top
C40  24.62,35.3 180 top
D5  18.04,38.39 180 top
D6  18.23,35.76 180 top
IC1  128.27,79.95 270 top
IC2  26.67,79.95 270 top
IC3  59.3,25.8 0 top
IC4  11.4,58.4 0 top
IC7  63.2,59.6 0 bottom
JP1  141.7,44.6 0 top
JP2  29.8,44.8 0 top
JP3  43.7,4.5 270 top
JP4  36.6,4.6 270 top
JP5  50.9,35.9 0 top
JP6  51,32.1 0 top
JP7  41.4,50.1 0 top
JP8  41.4,46.7 0 top
LED1  33.4,31.3 0 top
LED2  71.7,3.7 0 top
LED3  45.1,16.3 0 top
LED4  150.6,10.8 0 top
LED5  152.2,31 0 top
LED6  130.7,4.3 0 top
OK1  125,67.3 180 top
OK2  10.9,74.7 0 top
OK3  38.1,68 0 top
R1  39.5,31 0 top
R2  76.2,3.3 180 top
R3  50.9,15.7 0 top
R4  144.9,10.7 180 top
R5  146.7,31.1 180 top
R6  7.17,16.67 180 top
R7  10.92,24.54 180 top
R8  125,4.5 180 top
R9  38.7,23.2 0 top
R10  31.7,60.4 0 top
R11  126.6,75.6 0 top
R12  10.5,67 0 top
R62  7.84,30.94 270 top
R63  14.29,35.94 0 top
R64  14.12,38.43 0 top
R65  11.39,18.02 0 top
R66  23.04,23.39 0 top
SV1  132.5,44.5 0 top
SV2  20.7,44.8 0 top
SV3  81.1,28 0 top
SV4  130.8,24.3 270 top
SW1  29.03,14.92 0 top
T1  16.36,21.76 0 top
T2  46.3,24.5 180 top
U1  2.25,24.23 0 top
U2  29.2,70 0 top
U4  135.5,71.4 0 top
U$1  71.72,68.52 270 bottom
U$2  90.17,68.52 270 bottom
U$3  55.88,44.39 0 top
U$4  11.86,27.38 180 top
U$5  2.05,9.69 90 bottom
U$6  16.64,31.02 270 top
U$7  25.14,31.06 0 top
U$8  101.65,10 90 bottom
U$9  49.83,47.23 0 top
U$10  49.83,89.34 0 top
U$11  112,89.7 180 top
U$12  111.9,47.5 180 top
U$13  138.6,67.4 0 bottom
U$14  134.2,64 0 top
U$15  19.8,69 0 top
U$16  29.7,72.2 0 bottom
U$17  49.9,68.1 0 top
U$18  111.9,68.4 180 top
U$19  81.3,87.2 270 bottom
U$20  81.4,54.4 0 bottom
X1  82,3.1 0 bottom

### Tracks (layer width: path | path; a pad name or v marks a point on that pad's centre or on a via)
GND
  Top 0.254: JP3.3 43.62,2.02 36.62,2.02 JP4.3 | 61.88,25.27 59.5,25.27 57,22.77 IC3.1 56.88,22.77 56,23.65 C8.2 54.12,23.65 46.88,16.4 46.38,16.4 LED3.K | 61.88,25.27 64.12,25.27 C7.2 | C38.C 15.75,13.4 14.75,12.4 11.5,12.4 10.38,13.53 C39.C 10.25,13.65 8.12,15.78 8.12,16.65 R6.1 8.12,16.77 8.12,18.52 15.88,26.27 16,26.27 | 16.5,24.65 16.62,24.65 T1.6 | 16.5,24.65 16.12,24.65 T1.7 16,24.77 16,26.27 | 16,26.27 16,28.4 14.12,30.27 U$6.3 14.12,30.4 14.88,31.15 14.88,32.15 14.12,32.9 U$6.1 14,32.9 12.38,32.9 | 12.38,32.9 10.38,32.9 9.38,31.9 7.88,31.9 R62.1 | R66.1 22.12,23.4 17.62,23.4 16.5,24.52 16.5,24.65 | 12.38,32.9 12.38,39.15 16.88,43.65 16.88,44.77 SV2.1 | C3.2 6.62,56.02 8.38,56.02 9,55.4 IC4.1 9.12,55.4 11.5,57.77 16,57.77 C2.2 16.12,57.9 16.12,70.03 | 25.56,70.21 27.62,68.15 U2.1 27.62,68.03 27.62,64.15 26.75,63.27 26.75,58.27 | 25.56,70.21 24.38,71.4 21.88,71.4 C1.2 21.75,71.53 20.88,72.4 19.5,72.4 17.12,70.03 16.12,70.03 | 16.12,70.03 12.25,70.03 OK2.2 | 26.75,58.27 26.75,57.15 IC2.16 | 37.94,58.21 36.88,57.15 IC2.12 | 37.94,58.21 39.25,59.52 39.25,63.15 OK3.2 | 34.75,44.9 38.38,44.9 40.12,46.65 JP8.1 | 34.75,44.9 31.12,44.9 JP2.2 | 34.75,44.9 34.75,31.4 LED1.K | 26.75,58.27 37.88,58.27 37.94,58.21 | JP7.2 42.75,50.02 45.5,47.27 49.75,47.27 U$9.1 49.88,47.27 63.62,47.27 U$9.2 61.88,47.15 61.88,25.27 | U$1.P$1 71.62,68.4 71.38,68.15 63.88,68.15 U$17.2 63.75,68.15 50,68.15 U$17.1 | U$11.1 112,89.78 98.12,89.78 U$11.2 98,89.65 83.75,89.65 U$19.P$1 83.25,89.28 63.75,89.28 U$10.2 63.62,89.4 49.88,89.4 U$10.1 51.25,89.28 42,80.03 IC2.7 41.88,79.9 40.75,78.78 34.12,78.78 25.56,70.21
  Top 0.254: U$2.P$1 90.25,68.4 U$18.2 U$18.1 120,68.4 123.62,72.03 OK1.2 123.75,72.03 124.12,72.03 126.62,69.53 127.75,69.53 | LED4.K 151.88,10.9 151.88,29.4 153.38,30.9 LED5.K 153.38,31.02 153.38,34.15 143,44.52 JP1.2 | C9.2 134.12,66.4 134.12,69.28 134,69.4 U4.1 133.88,69.53 127.75,69.53 | 128.62,47.52 128.62,56.77 128.38,57.02 IC1.16 128.25,57.15 127.75,57.65 127.75,69.53 | 128.62,47.52 128.62,44.52 SV1.1 | 128.62,47.52 112,47.52 U$12.1 111.88,47.52 98,47.52 U$12.2 98,47.4 93.25,42.65 | 93.25,42.65 87.5,36.9 87.5,28.02 SV3.7 | 93.25,42.65 81.5,54.4 U$20.P$1
  Bottom 0.254: JP3.3 43.75,2.02 43.75,2.9 46.25,5.4 46.25,16.27 LED3.K | JP8.1 40.25,46.77 42.62,49.15 42.62,50.02 JP7.2 42.62,50.15 36.88,55.9 36.88,57.02 IC2.12 | SV2.1 17,44.9 17,47.4 26.62,57.02 IC2.16 | U$1.P$1 71.75,68.53 74.25,71.03 74.25,74.78 U$1.2 74.38,74.9 74.38,80.28 U$19.P$1 | IC2.7 42,79.9 42,74.9 43.62,73.28 C10.- 43.75,73.15 43.75,64.15 C12.- | U$19.P$1 83.75,89.65 83.75,94.78 U$19.2 | C5.2 58.5,56.65 60.12,55.02 64.12,55.02 65.5,56.4 IC7.1 65.62,56.52 65.75,56.65 68,56.65 C6.2 68.12,56.65 79.25,56.65 81.38,54.52 U$20.P$1 81.5,54.4 84,51.9 90.25,51.9 U$20.2 | U$2.P$1 90.25,68.53 92.62,70.9 92.62,74.78 U$2.2 92.5,74.78 80.75,86.53 U$19.P$1 | 132.75,12.03 132.75,5.15 132,4.4 LED6.K | 132.75,12.03 132.75,18.52 130.88,20.4 SV4.5 | 132.75,12.03 150.62,12.03 151.75,10.9 LED4.K | LED2.K 73,3.77 73.88,4.65 84.12,4.65 85.5,6.03 X1.1 85.62,6.4 87.38,8.15 87.38,27.9 SV3.7 | IC1.7 143.62,79.9 143.62,79.53 151.75,71.4 C4.- 151.88,71.28 151.88,63.4 C11.- 151.75,63.27 151.75,60.65 143,51.9 142.88,51.9 | 142.88,51.9 142.88,52.65 138.5,57.02 IC1.12 138.38,57.15 137.5,57.15 136.38,58.27 129.5,58.27 128.38,57.15 IC1.16 | 142.88,51.9 142.88,44.65 JP1.2
  pour Bottom: -2.2,101.4 165.5,101.4 165.5,-3.7 -2.2,-3.7
  pour Top: -2.8,102.1 166.1,102.1 166.1,-4.8 -2.8,-4.8
IR  (via drill 0.61)
  Top 0.254: v44.12,23.15 39.62,23.15 R9.2
  Bottom 0.254: v44.12,23.15 49.25,23.15 70.75,1.65 82.12,1.65 110.38,29.9 110.38,63.77 127.75,81.15 139.75,81.15 140.88,80.03 IC1.6
L_3V3
  Top 0.254: SV4.6 141.88,29.02 141.88,52.9 146,57.02 IC1.9
L_IO0
  Top 0.254: JP1.1 140.5,44.65 140.5,56.65 140.88,57.02 IC1.11
L_RX  (via drill 0.61)
  Top 0.254: IC1.14 133.25,57.02 131.25,55.02 131.25,44.52 SV1.2 131.12,44.4 96,9.28 v80.88,9.28
  Bottom 0.254: X1.4 82.5,7.53 80.81,9.21 | 80.81,9.21 58,32.02 52.38,32.02 JP6.2 | v80.88,9.28 80.81,9.21
L_SCL
  Top 0.254: SV4.4 130.88,23.15 139.25,31.52 139.25,56.15 139.75,56.65 139.75,61.15 140.25,61.65 140.25,78.15 138.5,79.9 IC1.5
L_SDA
  Bottom 0.254: SV4.3 130.75,25.65 127,29.4 127,57.77 134.12,64.9 138.62,64.9 139,65.28 139,76.9 136,79.9 IC1.4
L_TX  (via drill 0.61)
  Top 0.254: v57.5,31.15 55.62,31.15 52.75,34.02 51.62,34.02 49.75,35.9 JP5.1 | v81,7.78 82,8.78 97.88,8.78 133.5,44.4 133.75,44.4 SV1.3
  Bottom 0.254: IC1.15 133.75,54.15 133.75,44.52 SV1.3 | X1.5 81.5,7.15 80.94,7.71 | v57.5,31.15 80.94,7.71 | v81,7.78 80.94,7.71
LASER1  (via drill 0.61)
  Top 0.254: v37.62,60.4 R10.2 | v39.75,74.28 122.88,74.28 127.38,78.78 129.62,78.78 130.75,79.9 IC1.2
  Bottom 0.254: v37.62,60.4 39.75,62.52 v39.75,74.28
LASER2
  Top 0.254: R11.2 127.5,75.65 129,75.65 133.25,79.9 IC1.3
LASER_3V3  (via drill 0.61)
  Top 0.254: v46.75,62.77 36.88,72.65 OK3.4 | IC3.3 61.62,22.77 62.5,23.65 C7.1 64.25,23.77 68.5,28.02 68.5,60.27 70.25,62.02 v72.75,62.02 84.5,62.02 85.12,61.4 124.75,61.4 125.88,62.52 126.25,62.52 OK1.4
  Bottom 0.254: v46.75,62.77 63.12,62.77 IC7.4 63.25,62.65 63.25,56.65 IC7.2 63.25,56.52 65.12,58.4 68,58.4 C6.1 68.12,58.52 69.25,58.52 v72.75,62.02
LED_1V5  (via drill 0.61)
  Top 0.254: 52.88,25.4 54.12,25.4 C8.1 57.62,28.77 59.25,28.77 IC3.4 | 52.88,25.4 46.38,25.4 T2.1 | v57.38,20.77 59.25,22.65 IC3.2 | v52.88,25.27 52.88,25.4
  Bottom 0.254: v52.88,25.27 v57.38,20.77
LEFT_CAM_5V
  Top 0.254: C9.1 135.75,66.4 135.75,69.4 135.5,69.65 U4.2 135.62,69.78 137,71.15 | 137,71.15 135.88,72.28 135.5,72.28 U4.4 | 137,71.15 137.06,71.09 | 137.06,71.09 138.75,69.4 138.75,62.65 U$14.2 138.75,62.52 137.25,61.02 137.25,56.77 136.38,55.9 136.38,44.52 SV1.4 | IC1.8 146,80.03 145.12,80.03 144,81.15 137.88,81.15 137.12,80.4 137.12,71.15 137.06,71.09
  Bottom 0.254: IC1.8 146,80.03 145.12,80.03 144,81.15 143,81.15 142.25,80.4 142.25,74.53 145.38,71.4 C4.+ 145.5,71.28 145.5,63.4 C11.+
M1  (via drill 0.61)
  Top 0.254: v41.5,63.9 40.62,63.02 40.62,56.65 39.88,55.9 39.75,55.9 29.88,46.02 29.88,27.77 43.62,14.03 43.62,7.15 JP3.1
  Bottom 0.254: v41.5,63.9 41.5,77.78 39.38,79.9 IC2.6
M2
  Bottom 0.254: JP4.1 36.5,7.15 36.5,22.77 15.75,43.52 15.75,70.78 23.75,78.78 28,78.78 29.12,79.9 IC2.2
N$1  (via drill 3.3)
  other vias: 59.84,6.25
N$2  (via drill 3.3)
  other vias: 96.94,6.21
N$3
  Top 0.406: U1.VBUS1 9.03,25.53 R7.2
N$4  (via drill 0.61)
  Top 0.254: 12.25,16.4 v12.25,15.03 12.25,14.9 13.5,13.65 C39.A | 12.25,16.4 12.25,17.9 R65.2 | 24.88,16.4 24.88,15.9 SW1.COM1 26.88,13.9 26.88,12.53 36,3.4 43.88,3.4 45.38,1.9 76.25,1.9 76.38,2.02 v107.62,2.02 | 24.88,16.4 24.88,17.9 27.62,20.65 27.62,34.77 26,36.4 22.12,36.4 21.62,35.9 21.62,31.52 19.25,29.15 U$6.5 | 24.88,16.4 12.25,16.4
  Bottom 0.254: v12.25,15.03 12.25,6.03 U$5.B+ | v107.62,2.02 111.88,6.28 U$8.B+
N$5  (via drill 0.61)
  Top 0.254: v68.38,72.78 OK3.3
  Bottom 0.254: U$1.1 70.38,74.78 v68.38,72.78 68.38,72.65 66.88,71.15 66.88,66.53 69.75,63.65 82.88,63.65 90.25,56.27 90.25,55.77 U$20.1
N$6  (via drill 0.61)
  Top 0.254: v89.25,62.52 123.62,62.52 OK1.3 | v73.38,88.4 73.38,86.15 v84.38,75.15
  Bottom 0.254: v89.25,62.52 85.25,66.53 85.25,71.15 86.81,72.71 | 86.81,72.71 88.88,74.78 U$2.1 | v73.38,88.4 79.75,94.78 80,94.78 U$19.1 | 86.81,72.71 v84.38,75.15
N$7
  Top 0.254: R10.1 30.88,60.4 33.62,63.15 36.75,63.15 OK3.1
N$8
  Top 0.254: R11.1 125.75,72.65 126.25,72.15 OK1.1
N$9
  Top 0.254: R1.1 38.62,30.9 36,30.9 35.12,30.02 33.5,30.02 32.25,31.27 LED1.A
N$10
  Top 0.254: R2.1 77,3.27 76.25,2.52 76.12,2.52 76,2.4 71.75,2.4 70.5,3.65 LED2.A
N$11
  Top 0.254: U$4.2 10.25,26.9 10.25,26.15 11.75,24.65 R7.1
N$12
  Top 0.406: R6.2 6.27,22.73 6.07,22.93 U1.GND1 3.55,22.93 U1.GND
N$13
  Top 0.254: R3.1 50,15.65 47.38,15.65 46.75,15.03 45.12,15.03 43.88,16.27 LED3.A
N$14
  Top 0.254: R4.1 145.75,10.78 149.25,10.78 LED4.A
N$15
  Top 0.254: R5.1 147.62,31.02 150.88,31.02 LED5.A
N$16
  Top 0.254: R8.1 125.88,4.4 129.38,4.4 LED6.A
N$17  (via drill 0.61)
  Top 0.254: U4.3 137,69.4 137,65.4 U$14.1 134.25,62.52 v134.25,60.77
  Bottom 0.254: v134.25,60.77 136,62.52 U$13.P2
N$18
  Top 0.254: R5.2 145.75,31.02 145.75,12.4 R4.2 144,10.65 130.38,10.65 124.25,4.53 R8.2 124.12,4.4 98.75,4.4 98,3.65 78.25,3.65 77.75,4.15 74.38,4.15 74.31,4.09 | R1.2 40.38,30.9 40.38,30.02 46.88,23.52 47.12,23.52 T2.2 46.88,23.4 46.88,21.02 42.62,16.77 42.62,15.78 43.88,14.53 50.5,14.53 51.62,15.65 R3.2 51.75,15.65 62.75,15.65 74.31,4.09 | 74.31,4.09 75,3.4 75.25,3.4 R2.2
N$19  (via drill 0.61)
  Top 0.254: v30.62,66.65 30.62,68.03 U2.3 | v21.25,69.03 19.88,67.65 U$15.1
  Bottom 0.254: U$16.P2 27.12,67.4 27.88,66.65 v30.62,66.65 30.62,66.78 31.88,68.03 31.88,70.65 29.88,72.65 24.38,72.65 21.25,69.53 v21.25,69.03
N$20
  Top 0.254: R12.1 9.62,67.03 9.62,69.9 OK2.1
N$21
  Top 0.254: T2.3 45.25,23.52 45,23.52 44.38,24.15 38.75,24.15 37.88,23.27 R9.1
N$22  (via drill 0.61)
  Top 0.254: v19.5,73.28 13.38,79.4 12.25,79.4 OK2.3 | JP8.2 42.62,46.77 42.62,47.65 40.25,50.02 JP7.1
  Bottom 0.254: v19.5,73.28 19.5,68.53 30.5,57.52 30.5,56.65 37,50.15 40.12,50.15 JP7.1
N$58
  Top 0.254: U$6.2 14,31.65 9.88,31.65 8.38,30.15 7.88,30.15 R62.2
N$59  (via drill 0.61)
  Top 0.254: v17.88,31.77 19.12,31.77 U$6.7 | v15,34.65 14.75,34.65 13.5,35.9 R63.1
  Bottom 0.254: v15,34.65 v17.88,31.77
N$60
  Top 0.254: U$6.6 19.12,30.4 18,30.4 17,31.4 17,34.02 18.25,35.27 18.25,36.27 17,37.52 14.25,37.52 13.38,38.4 R64.1
N$61
  Top 0.254: D6.C 17.25,35.77 15.38,35.77 15.25,35.9 R63.2
N$62
  Top 0.254: D5.C 17.12,38.4 15,38.4 R64.2
N$65
  Top 0.254: 25.25,34.02 25.25,35.15 25.38,35.27 C40.1 | 25.25,34.02 25.25,32.27 U$7.5 | R65.1 10.62,18.02 11.5,18.9 14.25,18.9 15.12,18.02 20.88,18.02 27.12,24.27 27.12,32.27 25.38,34.02 25.25,34.02
N$66  (via drill 0.61)
  Top 0.254: T1.2 16.12,18.9 16.62,18.9 T1.3 16.62,19.02 16.62,19.4 19.75,22.52 24.62,22.52 26.62,24.52 26.62,30.4 25.5,31.52 24.75,31.52 24.12,32.15 U$7.6 24.12,32.27 24.12,34.02 | 24.12,34.02 24.12,35.02 23.88,35.27 C40.2 | v24,34.02 24.12,34.02 | v87.25,90.78 86.75,90.78 83.88,93.65 v16.75,93.65
  Bottom 0.254: v24,34.02 12.38,45.65 12.38,90.28 U$5.B- 12.5,89.4 v16.75,93.65 | v87.25,90.78 111.88,90.78 U$8.B-
N$67  (via drill 0.61)
  Top 0.254: v24.12,25.65 24.12,29.9 U$7.1 | v18.12,19.65 17.38,18.9 T1.4
  Bottom 0.254: v18.12,19.65 v24.12,25.65
N$68
  Top 0.254: U$7.2 25.12,29.9 25.12,24.52 24,23.4 R66.2
N$69
  Top 0.254: T1.1 15.38,18.9 15.38,24.65 T1.8
N$70
  Top 0.254: U$7.3 26,30.02 25.5,30.52 23.12,30.52 17.38,24.77 T1.5
R_3V3
  Bottom 0.254: SV3.8 89.88,28.02 63.38,54.52 47,54.52 44.5,57.02 IC2.9
R_INT
  Bottom 0.254: SV3.1 72.12,28.02 71,28.02 42,57.02 IC2.10
R_IO0
  Top 0.254: JP2.1 28.62,44.9 28.62,46.4 39.25,57.02 IC2.11
R_RX  (via drill 0.61)
  Top 0.254: v30.25,55.65 31.75,57.15 IC2.14
  Bottom 0.254: v30.25,55.65 29.44,54.84 | 29.44,54.84 19.5,44.9 SV2.2 | X1.6 80.5,6.03 81.25,5.28 82.75,5.28 83,5.53 83,8.4 55.5,35.9 JP5.2 52.12,36.02 50.38,37.77 46.5,37.77 29.44,54.84
R_SCL
  Bottom 0.254: SV3.6 84.88,27.9 84.62,27.9 82.75,26.02 71.25,26.02 40.62,56.65 40.62,76.15 36.88,79.9 IC2.5
R_SDA  (via drill 0.61)
  Top 0.254: v69.38,59.9 69.38,55.65 82.25,42.77 82.25,28.02 SV3.5
  Bottom 0.254: v69.38,59.9 48.12,81.15 35.5,81.15 34.38,80.03 IC2.4
R_TX
  Top 0.254: SV2.3 22,44.77 23.88,42.9 25,42.9 27.38,45.27 27.38,55.27 29.12,57.02 IC2.15
  Bottom 0.254: X1.7 79.5,6.65 62.62,23.52 58.25,23.52 49.75,32.02 JP6.1 49.62,32.15 49.25,32.52 34.25,32.52 22,44.77 SV2.3
RIGHT_CAM_5V  (via drill 0.61)
  Top 0.254: C1.1 24,67.65 24.38,67.65 U$15.2 24.5,67.53 24.5,64.53 | 24.5,64.53 24.5,44.9 SV2.4 | U2.2 29.25,68.4 29.25,70.9 U2.4 29.38,70.9 32.38,73.9 35.12,73.9 | 35.12,73.9 37.62,73.9 43.62,79.9 44.38,79.9 IC2.8 | 35.12,73.9 v35.12,73.28 | v26.75,64.53 24.5,64.53
  Bottom 0.254: v35.12,73.28 37.25,73.28 C10.+ 37.38,73.15 37.38,64.15 C12.+ 37.25,64.53 v26.75,64.53
S
  Top 0.254: R12.2 11.25,67.03 11.25,68.65 10.88,69.03 10.88,80.4 11.62,81.15 30.62,81.15 31.75,80.03 IC2.3
SHUTTER_3V3
  Top 0.254: 8.44,58.46 11.38,61.4 IC4.4 | 8.44,58.46 7.75,57.77 6.62,57.77 C3.1 5.75,56.9 5.75,55.27 7.25,53.77 9.88,53.77 11.38,55.27 IC4.2 | OK2.4 9.62,79.4 9.62,72.15 8.38,70.9 8.38,58.52 8.44,58.46
VBUS
  Top 0.254: U$6.8 19.12,33.02 19.12,35.65 D6.A 19,35.77 19,38.27 D5.A 18.88,38.4 18.88,43.02 18,43.9 18,46.02 17.25,46.77 16.5,46.77 7,37.27 7,29.4 8.62,27.77 12.62,27.77 12.69,27.71 | 12.69,27.71 14,29.02 U$6.4 | 12.69,27.71 12.56,27.59 | 12.56,27.59 12,27.02 U$4.1 | C38.A 19.88,13.4 18.38,11.9 9.75,11.9 7.25,14.4 7.25,18.4 12.62,23.77 12.62,27.52 12.56,27.59
VCC  (via drill 0.61)
  Top 0.254: JP3.2 43.62,4.53 36.62,4.53 JP4.2 36.5,4.65 35.5,4.65 27.38,12.78 27.38,14.9 25.88,16.4 25.88,17.4 SW1.CH1A 25.88,17.52 25.88,18.15 28.38,20.65 28.38,36.02 20.62,43.77 20.62,51.52 16.12,56.02 C2.1 | C2.1 14.5,56.15 13.75,55.4 IC4.3 | v22.62,67.15 22.62,62.77 16.12,56.27 C2.1 | v31,69.53 37.12,69.53 v48.25,58.4 48.38,58.4 53.38,63.4 v111.25,63.4
  Bottom 0.254: IC7.3 60.88,56.52 59.12,58.27 58.5,58.27 C5.1 58.38,58.4 v48.25,58.4 | 25.06,69.59 26.62,71.15 27,71.15 U$16.P1 | 25.06,69.59 v22.62,67.15 | v31,69.53 25.12,69.53 25.06,69.59 | U$13.P1 114.25,66.4 v111.25,63.4

### Text on the board
tPlace: 5V | Structured Light | 5V | Left-CAM | Right-CAM | Shutter | GND / R_RX / R_TX / 5V | R_IO0 / GND | GND / L_RX / L_TX / 5V | L_IO0 / GND | GND IO / IO GND | L_TX < - > R_RX | R_TX < - > L_RX | IMU | ToF | R_SDA / R_SCL / GND / R_3V3 | L_SDA / L_SCL / GND / L_3V3 | Srereo Camera v1 / 20191218 TonyGUO | Signal / VCC / GND
bPlace: R_TX / R_RX / L_TX / LRX / / GND